# EAGLE schematic 2017-09-15_drum_circuits (EAGLE 7.6.0)
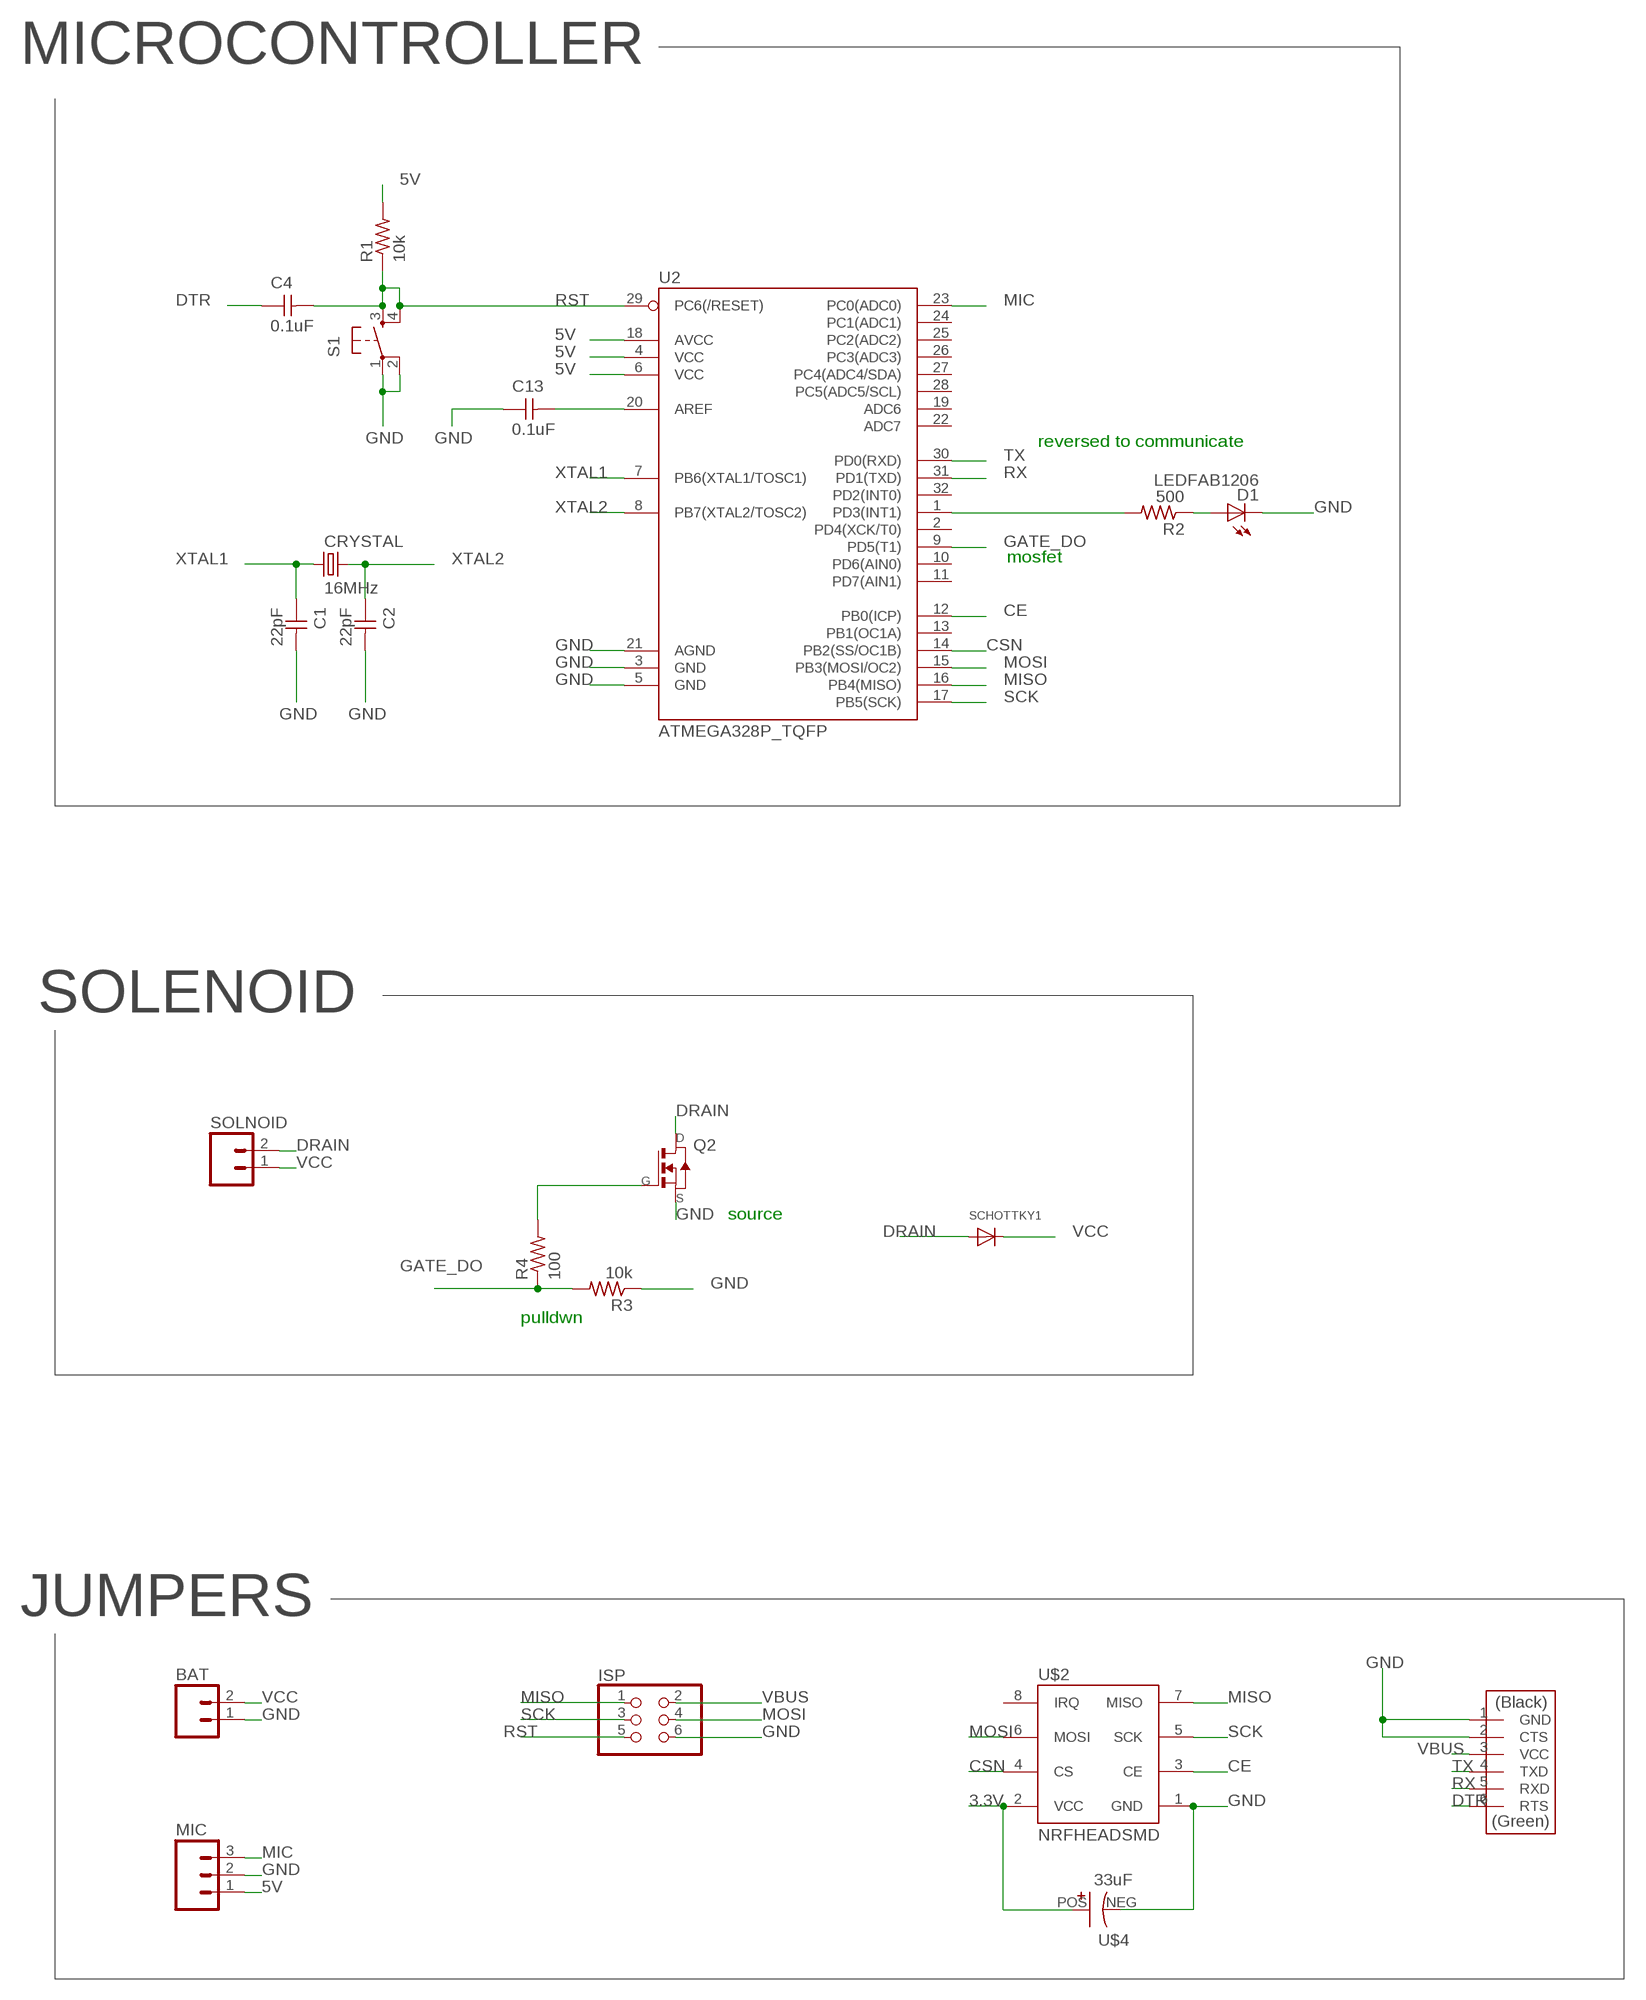
[diagram p0: schematic, sheet 1, part 1 of 2]
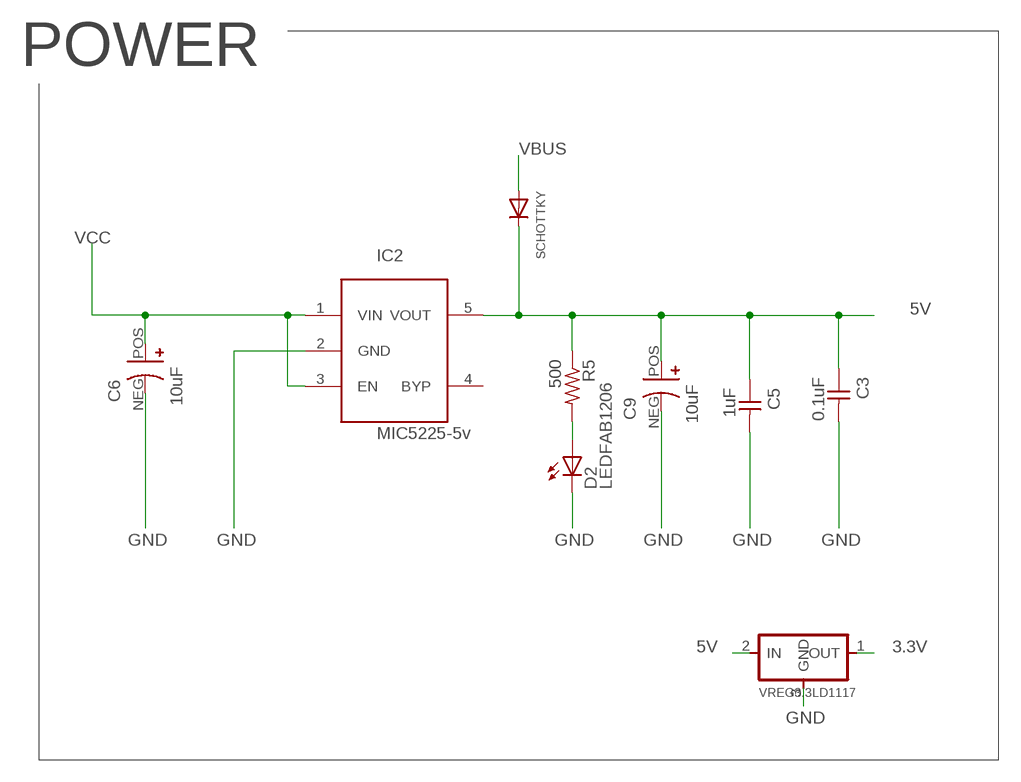
[diagram p1: schematic, sheet 1, part 2 of 2]

## Parts
BAT  M02PTH  [1X02]
C1  22pF  CAP-UNPOLARIZEDFAB  [C1206FAB]
C2  22pF  CAP-UNPOLARIZEDFAB  [C1206FAB]
C3  0.1uF  CAP-UNPOLARIZEDFAB  [C1206FAB]
C4  0.1uF  CAP-UNPOLARIZEDFAB  [C1206FAB]
C5  1uF  CAP-UNPOLARIZEDFAB  [C1206FAB]
C6  10uF  POLCAP-PANASONIC-SMD-B01  [PANASONIC-CAP-SMD-B]
C9  10uF  POLCAP-PANASONIC-SMD-B01  [PANASONIC-CAP-SMD-B]
C13  0.1uF  CAP-UNPOLARIZEDFAB  [C1206FAB]
CRYSTAL  16MHz  CRYSTAL  [2-SMD-5X3MM]
D1  LEDFAB1206  [LED1206FAB]
D2  LEDFAB1206  [LED1206FAB]
IC2  MIC5225-5v  LP298XS  [SOT23-5L]
ISP  PINHD-2X3-SMD  [2X03SMD]
MIC  M03PTH  [1X03]
Q2  NMOSFETSOT23  [SOT-23]
R1  10k  RES-US1206FAB  [R1206FAB]
R2  500  RES-US1206FAB  [R1206FAB]
R3  10k  RES-US1206FAB  [R1206FAB]
R4  100  RES-US1206FAB  [R1206FAB]
R5  500  RES-US1206FAB  [R1206FAB]
S1  6MM_SWITCH6MM_SWITCH  [6MM_SWITCH]
SCHOTTKY  DIODE_SOD-123FL  [SOD-123FL]
SCHOTTKY1  DIODE_SOD-123FL  [SOD-123FL]
SOLNOID  M02PTH  [1X02]
U2  ATMEGA328P_TQFP  [TQFP32-08]
U$1  FTDI-SMD-HEADER  [1X06SMD]
U$2  NRFHEADSMD  [2.54MM]
U$4  33uF  POLCAP-PANASONIC-SMD-C  [PANASONIC-CAP-SMD-C]
VREG3.3  LD1117  REGULATORSOT23  [SOT23]

## Nets
3.3V: U$2.2(VCC) U$4.POS(+) VREG3.3.1(OUT)
5V: C3.1 C5.1 C9.POS(+) IC2.5(VOUT) MIC.1 R1.2 R5.1 SCHOTTKY.C U2.4(VCC) U2.6(VCC) U2.18(AVCC) VREG3.3.2(IN)
CE: U2.12(PB0(ICP)) U$2.3(CE)
CSN: U2.14(PB2(SS/OC1B)) U$2.4(CS)
DRAIN: Q2.1(D) SCHOTTKY1.A SOLNOID.2
DTR: C4.1 U$1.6(RTS)
GATE_DO: R3.2 R4.1 U2.9(PD5(T1))
GND: BAT.1 C1.2 C2.2 C3.2 C5.2 C6.NEG(-) C9.NEG(-) C13.1 D1.2(C) D2.2(C) IC2.2(GND) ISP.6 MIC.2 Q2.2(S) R3.1 S1.1(P) S1.2(P1) U2.3(GND) U2.5(GND) U2.21(AGND) U$1.1(GND) U$1.2(CTS) U$2.1(GND) U$4.NEG(-) VREG3.3.3(GND)
MIC: MIC.3 U2.23(PC0(ADC0))
MISO: ISP.1 U2.16(PB4(MISO)) U$2.7(MISO)
MOSI: ISP.4 U2.15(PB3(MOSI/OC2)) U$2.6(MOSI)
N$1: D1.1(A) R2.1
N$6: D2.1(A) R5.2
N$9: C13.2 U2.20(AREF)
N$10: R2.2 U2.1(PD3(INT1))
N$11: Q2.3(G) R4.2
RST: C4.2 ISP.5 R1.1 S1.3(S) S1.4(S1) U2.29(PC6(/RESET))
RX: U2.31(PD1(TXD)) U$1.5(RXD)
SCK: ISP.3 U2.17(PB5(SCK)) U$2.5(SCK)
TX: U2.30(PD0(RXD)) U$1.4(TXD)
VBUS: ISP.2 SCHOTTKY.A U$1.3(VCC)
VCC: BAT.2 C6.POS(+) IC2.1(VIN) IC2.3(EN) SCHOTTKY1.C SOLNOID.1
XTAL1: C1.1 CRYSTAL.P$1 U2.7(PB6(XTAL1/TOSC1))
XTAL2: C2.1 CRYSTAL.P$2 U2.8(PB7(XTAL2/TOSC2))
Unconnected: IC2.4(BYP) U2.2(PD4(XCK/T0)) U2.10(PD6(AIN0)) U2.11(PD7(AIN1)) U2.13(PB1(OC1A)) U2.19(ADC6) U2.22(ADC7) U2.24(PC1(ADC1)) U2.25(PC2(ADC2)) U2.26(PC3(ADC3)) U2.27(PC4(ADC4/SDA)) U2.28(PC5(ADC5/SCL)) U2.32(PD2(INT0)) U$2.8(IRQ)

## Notes on the sheet
- MICROCONTROLLER
- reversed to communicate
- mosfet
- SOLENOID
- source
- pulldwn
- JUMPERS
- POWER

## Library data of the parts
BAT SOLNOID = SparkFun-Connectors:M02: Standard 2-pin 0.1" header. Use with - straight break away headers ( PRT-00116) - right angle break away headers (PRT-00553) - swiss pins (PRT-00743) - machine pins (PRT-00117) - female headers (PRT-00115) Molex polarized connector foot print use with: PRT-08233 with associated crimp pins and housings. 2.54_SCREWTERM for use with PRT-10571. 3.5mm Screw Terminal footprints for PRT-08084 5mm Screw Terminal footprints for use with PRT-08432
C1-C5 C13 = fab:CAP-UNPOLARIZED
C6 C9 = talkingdrums:POLCAP-PANASONIC-SMD-B
CRYSTAL = fab:CRYSTAL
D1 D2 = fab:LED: LED
IC2 = adafruit:LP298X
ISP = fab:PINHD-2X3-SMD: PIN HEADER
MIC = SparkFun-Connectors:M03: Header 3 Standard 3-pin 0.1" header. Use with straight break away headers (SKU : PRT-00116), right angle break away headers (PRT-00553), swiss pins (PRT-00743), machine pins (PRT-00117), and female headers (PRT-00115). Molex polarized connector foot print use with SKU : PRT-08232 with associated crimp pins and housings.
Q2 = fab:NMOSFET: MOS FET
R1-R5 = fab:RES-US: Resistor (US Symbol) Variants with postfix FAB are widened to allow the routing of internal traces
S1 = fab:6MM_SWITCH: OMRON SWITCH
SCHOTTKY SCHOTTKY1 = adafruit:DIODE: Diode SMADIODE - SMA Surface Mount Package 20V 1A Schottky Diode Digikey: 641-1014-6-ND DO-1N4148 - Through Hole Small Current Diode SOD-123 20V 1 A (.5mV Vf) Schottky Diode - Digikey: MBRX120TPMSCT-ND SOD-323 10V 570mA (.38mV Vf, 3ns) Schottky Diode - Digikey: ZLLS410CT-ND SOD-523 30V 30mA Schottky Diode (RB751S-40TE61) - Digikey: RB751S-40TE61CT-ND SOT23-R/W - SOT23 Package (R = Solder Paste/Reflow Ovens, W = Hand-Soldering) BAT54Film 40V 300mA - Digikey: 497-7162-1-ND
U2 = SparkFun-DigitalIC:ATMEGA328P_TQFP; PROD_ID: IC-09069
U$1 = fab:FTDI-SMD-HEADER
U$2 = nrf:NRFHEAD
U$4 = talkingdrums:POLCAP-PANASONIC-SMD-C
VREG3.3 = fab:REGULATOR